# Altium schematic sheet RGB_LED.SchDoc
size A4
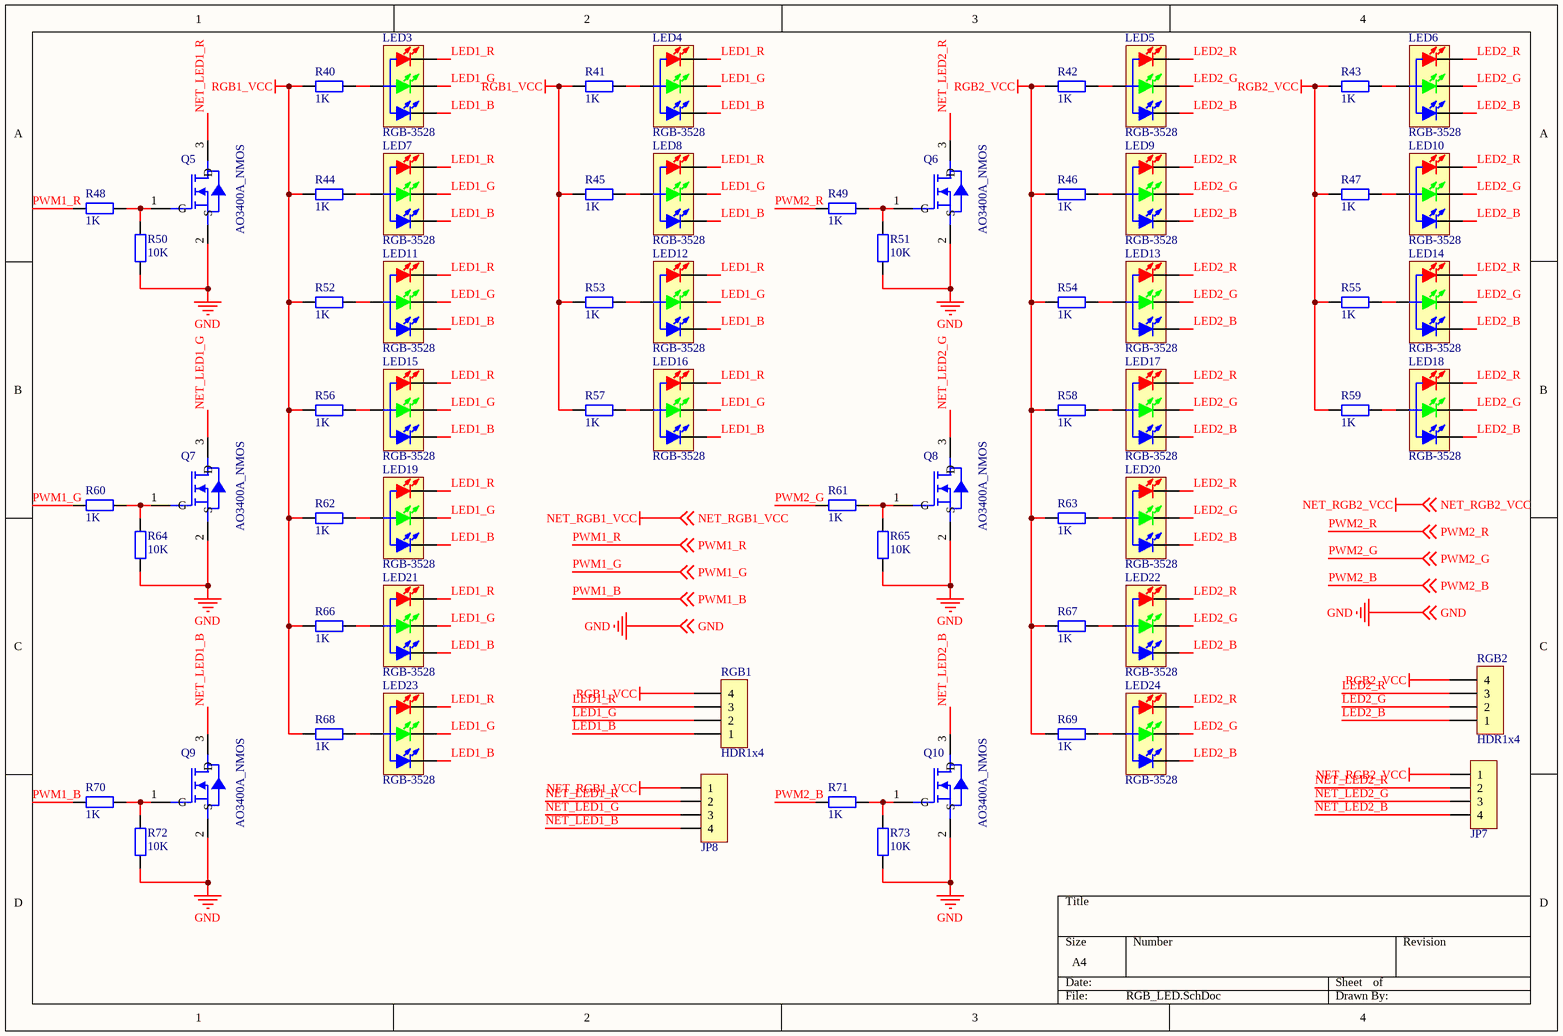
[diagram p0: RGB_LED.SchDoc]

## Parts
JP7  HDR-1X4  [MX 1.25-WS-4P]  (value not drawn)
JP8  HDR-1X4  [MX 1.25-WS-4P]  (value not drawn)
LED3  RGB-3528  [LED 3528-4Pin]
LED4  RGB-3528  [LED 3528-4Pin]
LED5  RGB-3528  [LED 3528-4Pin]
LED6  RGB-3528  [LED 3528-4Pin]
LED7  RGB-3528  [LED 3528-4Pin]
LED8  RGB-3528  [LED 3528-4Pin]
LED9  RGB-3528  [LED 3528-4Pin]
LED10  RGB-3528  [LED 3528-4Pin]
LED11  RGB-3528  [LED 3528-4Pin]
LED12  RGB-3528  [LED 3528-4Pin]
LED13  RGB-3528  [LED 3528-4Pin]
LED14  RGB-3528  [LED 3528-4Pin]
LED15  RGB-3528  [LED 3528-4Pin]
LED16  RGB-3528  [LED 3528-4Pin]
LED17  RGB-3528  [LED 3528-4Pin]
LED18  RGB-3528  [LED 3528-4Pin]
LED19  RGB-3528  [LED 3528-4Pin]
LED20  RGB-3528  [LED 3528-4Pin]
LED21  RGB-3528  [LED 3528-4Pin]
LED22  RGB-3528  [LED 3528-4Pin]
LED23  RGB-3528  [LED 3528-4Pin]
LED24  RGB-3528  [LED 3528-4Pin]
Q5  AO3400A_NMOS  [SOT-23-3_L2.9-W1.3-P1.90-LS2.4-BR]
Q6  AO3400A_NMOS  [SOT-23-3_L2.9-W1.3-P1.90-LS2.4-BR]
Q7  AO3400A_NMOS  [SOT-23-3_L2.9-W1.3-P1.90-LS2.4-BR]
Q8  AO3400A_NMOS  [SOT-23-3_L2.9-W1.3-P1.90-LS2.4-BR]
Q9  AO3400A_NMOS  [SOT-23-3_L2.9-W1.3-P1.90-LS2.4-BR]
Q10  AO3400A_NMOS  [SOT-23-3_L2.9-W1.3-P1.90-LS2.4-BR]
R40  1K  [R 0603_L]
R41  1K  [R 0603_L]
R42  1K  [R 0603_L]
R43  1K  [R 0603_L]
R44  1K  [R 0603_L]
R45  1K  [R 0603_L]
R46  1K  [R 0603_L]
R47  1K  [R 0603_L]
R48  1K  [R 0603_L]
R49  1K  [R 0603_L]
R50  10K  [R 0603_L]
R51  10K  [R 0603_L]
R52  1K  [R 0603_L]
R53  1K  [R 0603_L]
R54  1K  [R 0603_L]
R55  1K  [R 0603_L]
R56  1K  [R 0603_L]
R57  1K  [R 0603_L]
R58  1K  [R 0603_L]
R59  1K  [R 0603_L]
R60  1K  [R 0603_L]
R61  1K  [R 0603_L]
R62  1K  [R 0603_L]
R63  1K  [R 0603_L]
R64  10K  [R 0603_L]
R65  10K  [R 0603_L]
R66  1K  [R 0603_L]
R67  1K  [R 0603_L]
R68  1K  [R 0603_L]
R69  1K  [R 0603_L]
R70  1K  [R 0603_L]
R71  1K  [R 0603_L]
R72  10K  [R 0603_L]
R73  10K  [R 0603_L]
RGB1  HDR1x4  [1.25-4P-焊盘]
RGB2  HDR1x4  [1.25-4P-焊盘]

## Nets
GND: Q5.2(S) Q6.2(S) Q7.2(S) Q8.2(S) Q9.2(S) Q10.2(S) R50.1 R51.1 R64.1 R65.1 R72.1 R73.1 ; off-sheet GND
NET_RGB1_VCC: JP8.1 ; off-sheet NET_RGB1_VCC
NET_RGB2_VCC: JP7.1 ; off-sheet NET_RGB2_VCC
RGB1_VCC: R40.1 R41.1 R44.1 R45.1 R52.1 R53.1 R56.1 R57.1 R62.1 R66.1 R68.1 RGB1.4
RGB2_VCC: R42.1 R43.1 R46.1 R47.1 R54.1 R55.1 R58.1 R59.1 R63.1 R67.1 R69.1 RGB2.4
LED1_B: LED3.3(BULE_K) LED4.3(BULE_K) LED7.3(BULE_K) LED8.3(BULE_K) LED11.3(BULE_K) LED12.3(BULE_K) LED15.3(BULE_K) LED16.3(BULE_K) LED19.3(BULE_K) LED21.3(BULE_K) LED23.3(BULE_K) RGB1.1
LED1_G: LED3.2(GREEN_K) LED4.2(GREEN_K) LED7.2(GREEN_K) LED8.2(GREEN_K) LED11.2(GREEN_K) LED12.2(GREEN_K) LED15.2(GREEN_K) LED16.2(GREEN_K) LED19.2(GREEN_K) LED21.2(GREEN_K) LED23.2(GREEN_K) RGB1.2
LED1_R: LED3.1(RED_K) LED4.1(RED_K) LED7.1(RED_K) LED8.1(RED_K) LED11.1(RED_K) LED12.1(RED_K) LED15.1(RED_K) LED16.1(RED_K) LED19.1(RED_K) LED21.1(RED_K) LED23.1(RED_K) RGB1.3
LED2_B: LED5.3(BULE_K) LED6.3(BULE_K) LED9.3(BULE_K) LED10.3(BULE_K) LED13.3(BULE_K) LED14.3(BULE_K) LED17.3(BULE_K) LED18.3(BULE_K) LED20.3(BULE_K) LED22.3(BULE_K) LED24.3(BULE_K) RGB2.1
LED2_G: LED5.2(GREEN_K) LED6.2(GREEN_K) LED9.2(GREEN_K) LED10.2(GREEN_K) LED13.2(GREEN_K) LED14.2(GREEN_K) LED17.2(GREEN_K) LED18.2(GREEN_K) LED20.2(GREEN_K) LED22.2(GREEN_K) LED24.2(GREEN_K) RGB2.2
LED2_R: LED5.1(RED_K) LED6.1(RED_K) LED9.1(RED_K) LED10.1(RED_K) LED13.1(RED_K) LED14.1(RED_K) LED17.1(RED_K) LED18.1(RED_K) LED20.1(RED_K) LED22.1(RED_K) LED24.1(RED_K) RGB2.3
NET_LED1_B: JP8.4 Q9.3(D)
NET_LED1_G: JP8.3 Q7.3(D)
NET_LED1_R: JP8.2 Q5.3(D)
NET_LED2_B: JP7.4 Q10.3(D)
NET_LED2_G: JP7.3 Q8.3(D)
NET_LED2_R: JP7.2 Q6.3(D)
PWM1_B: R70.2 ; off-sheet PWM1_B
PWM1_G: R60.2 ; off-sheet PWM1_G
PWM1_R: R48.2 ; off-sheet PWM1_R
PWM2_B: R71.2 ; off-sheet PWM2_B
PWM2_G: R61.2 ; off-sheet PWM2_G
PWM2_R: R49.2 ; off-sheet PWM2_R
NetLED3_4: LED3.4(A) R40.2
NetLED4_4: LED4.4(A) R41.2
NetLED5_4: LED5.4(A) R42.2
NetLED6_4: LED6.4(A) R43.2
NetLED7_4: LED7.4(A) R44.2
NetLED8_4: LED8.4(A) R45.2
NetLED9_4: LED9.4(A) R46.2
NetLED10_4: LED10.4(A) R47.2
NetLED11_4: LED11.4(A) R52.2
NetLED12_4: LED12.4(A) R53.2
NetLED13_4: LED13.4(A) R54.2
NetLED14_4: LED14.4(A) R55.2
NetLED15_4: LED15.4(A) R56.2
NetLED16_4: LED16.4(A) R57.2
NetLED17_4: LED17.4(A) R58.2
NetLED18_4: LED18.4(A) R59.2
NetLED19_4: LED19.4(A) R62.2
NetLED20_4: LED20.4(A) R63.2
NetLED21_4: LED21.4(A) R66.2
NetLED22_4: LED22.4(A) R67.2
NetLED23_4: LED23.4(A) R68.2
NetLED24_4: LED24.4(A) R69.2
NetQ5_1: Q5.1(G) R48.1 R50.2
NetQ6_1: Q6.1(G) R49.1 R51.2
NetQ7_1: Q7.1(G) R60.1 R64.2
NetQ8_1: Q8.1(G) R61.1 R65.2
NetQ9_1: Q9.1(G) R70.1 R72.2
NetQ10_1: Q10.1(G) R71.1 R73.2

## Library data of the parts
JP7 JP8 = Header 4: 4P接插件
LED3-LED24 = LED-RGB 3528: 3528三基色LED
R40-R73 = R: 贴片电阻
RGB1 RGB2 = HDR1x4: Connector